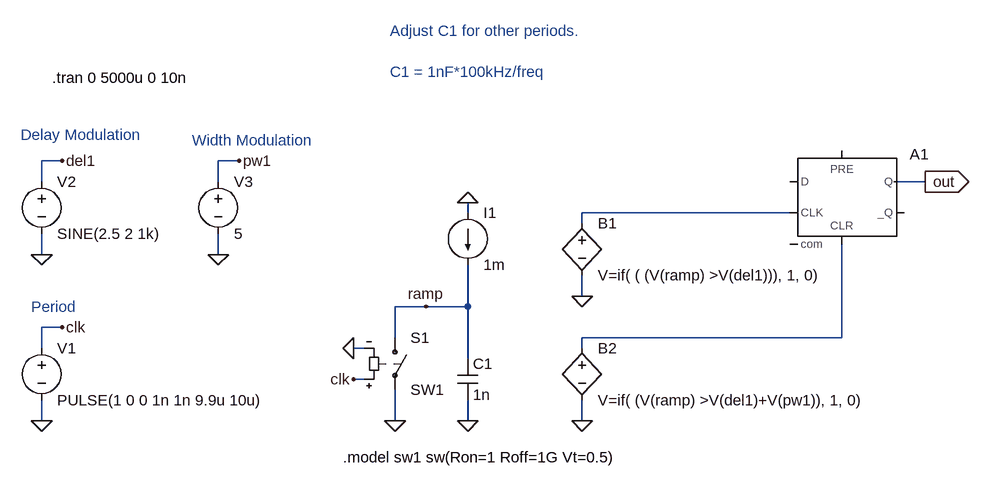
[diagram p0: schematic delay_and__width_modulator.asc]
delay_and__width_modulator.asc, the LTspice schematic file:
Version 4
SHEET 1 1112 680
WIRE -640 -16 -640 -48
WIRE -640 96 -640 64
WIRE -640 240 -640 208
WIRE -640 352 -640 320
WIRE -608 -48 -640 -48
WIRE -608 208 -640 208
WIRE -368 -16 -368 -48
WIRE -368 96 -368 64
WIRE -336 -48 -368 -48
WIRE -144 240 -160 240
WIRE -144 288 -160 288
WIRE -96 224 -96 176
WIRE -96 352 -96 304
WIRE -48 176 -96 176
WIRE 16 32 16 16
WIRE 16 176 -48 176
WIRE 16 176 16 112
WIRE 16 256 16 176
WIRE 16 352 16 320
WIRE 192 48 192 32
WIRE 192 160 192 128
WIRE 192 240 192 224
WIRE 192 352 192 320
WIRE 512 32 192 32
WIRE 592 224 192 224
WIRE 592 224 592 80
WIRE 720 -16 672 -16
FLAG 16 352 0
FLAG 16 16 0
FLAG 192 160 0
FLAG -640 352 0
FLAG -96 352 0
FLAG -160 240 0
FLAG -608 208 clk
FLAG -160 288 clk
FLAG -640 96 0
FLAG -608 -48 del1
FLAG -368 96 0
FLAG -336 -48 pw1
FLAG -48 176 ramp
FLAG 192 352 0
FLAG 720 -16 out
IOPIN 720 -16 Out
SYMBOL cap 0 256 R0
SYMATTR InstName C1
SYMATTR Value 1n
SYMBOL current 16 32 R0
SYMATTR InstName I1
SYMATTR Value 1m
SYMBOL bv 192 32 R0
SYMATTR InstName B1
SYMATTR Value V=if( ( (V(ramp) >V(del1))), 1, 0)
SYMBOL voltage -640 224 R0
WINDOW 123 0 0 Left 0
WINDOW 39 0 0 Left 0
SYMATTR InstName V1
SYMATTR Value PULSE(1 0 0 1n 1n 9.9u 10u)
SYMBOL sw -96 208 R0
SYMATTR InstName S1
SYMATTR Value SW1
SYMBOL voltage -640 -32 R0
WINDOW 123 0 0 Left 0
WINDOW 39 0 0 Left 0
SYMATTR InstName V2
SYMATTR Value SINE(2.5 2 1k)
SYMBOL voltage -368 -32 R0
WINDOW 123 0 0 Left 0
WINDOW 39 0 0 Left 0
SYMATTR InstName V3
SYMATTR Value 5
SYMBOL bv 192 224 R0
SYMATTR InstName B2
SYMATTR Value V=if( (V(ramp) >V(del1)+V(pw1)), 1, 0)
SYMBOL Digital\\dflop 592 -64 R0
SYMATTR InstName A1
SYMATTR Value2 td=10n
TEXT -176 408 Left 0 !.model sw1 sw(Ron=1 Roff=1G Vt=0.5)
TEXT -624 -176 Left 0 !.tran 0 5000u 0 10n
TEXT -672 -88 Left 0 ;Delay Modulation
TEXT -408 -80 Left 0 ;Width Modulation
TEXT -104 -248 Left 0 ;Adjust C1 for other periods.\n \nC1 = 1nF*100kHz/freq
TEXT -656 176 Left 0 ;Period

The netlist it stands for:
* delay_and__width_modulator.asc
C1 ramp 0 1n
I1 0 ramp 1m
B1 N001 0 V=if( ( (V(ramp) >V(del1))), 1, 0)
V1 clk 0 PULSE(1 0 0 1n 1n 9.9u 10u)
S1 ramp 0 clk 0 SW1
V2 del1 0 SINE(2.5 2 1k)
V3 pw1 0 5
B2 N002 0 V=if( (V(ramp) >V(del1)+V(pw1)), 1, 0)
A1 0 0 N001 0 N002 0 out 0 DFLOP td=10n
.model sw1 sw(Ron=1 Roff=1G Vt=0.5)
.tran 0 5000u 0 10n
* Delay Modulation
* Width Modulation
* Adjust C1 for other periods.
* C1 = 1nF*100kHz/freq
* Period
.backanno
.end